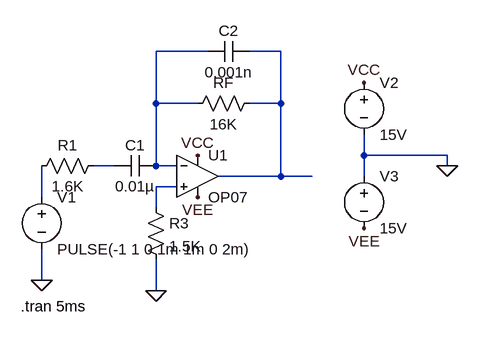
[diagram p0: schematic Draft2.asc]
Draft2.asc, the LTspice schematic file:
Version 4
SHEET 1 880 680
WIRE 208 -32 128 -32
WIRE 320 -32 272 -32
WIRE 128 48 128 -32
WIRE 192 48 128 48
WIRE 320 48 320 -32
WIRE 320 48 272 48
WIRE 448 128 448 96
WIRE 576 128 448 128
WIRE 64 144 32 144
WIRE 128 144 128 48
WIRE 160 144 128 144
WIRE 576 144 576 128
WIRE 320 160 320 48
WIRE 320 160 224 160
WIRE 368 160 320 160
WIRE 448 160 448 128
WIRE 160 176 128 176
WIRE -48 192 -48 144
WIRE 128 208 128 176
WIRE -48 320 -48 272
WIRE 128 336 128 288
FLAG -48 320 0
FLAG 576 144 0
FLAG 448 16 VCC
FLAG 192 128 VCC
FLAG 448 240 VEE
FLAG 192 192 VEE
FLAG 128 336 0
SYMBOL OpAmps\\OP07 192 96 R0
SYMATTR InstName U1
SYMBOL res 48 128 R90
WINDOW 0 0 56 VBottom 2
WINDOW 3 32 56 VTop 2
SYMATTR InstName R1
SYMATTR Value 1.6K
SYMBOL res 288 32 R90
WINDOW 0 0 56 VBottom 2
WINDOW 3 32 56 VTop 2
SYMATTR InstName RF
SYMATTR Value 16K
SYMBOL cap 128 128 R90
WINDOW 0 0 32 VBottom 2
WINDOW 3 32 32 VTop 2
SYMATTR InstName C1
SYMATTR Value 0.01µ
SYMBOL res 112 192 R0
SYMATTR InstName R3
SYMATTR Value 1.5K
SYMBOL cap 272 -48 R90
WINDOW 0 0 32 VBottom 2
WINDOW 3 32 32 VTop 2
SYMATTR InstName C2
SYMATTR Value 0.001n
SYMBOL voltage -48 176 R0
WINDOW 123 0 0 Left 0
WINDOW 39 0 0 Left 0
SYMATTR InstName V1
SYMATTR Value PULSE(-1 1 0 1m 1m 0 2m)
SYMBOL voltage 448 0 R0
WINDOW 123 0 0 Left 0
WINDOW 39 0 0 Left 0
SYMATTR InstName V2
SYMATTR Value 15V
SYMBOL voltage 448 144 R0
WINDOW 123 0 0 Left 0
WINDOW 39 0 0 Left 0
SYMATTR InstName V3
SYMATTR Value 15V
TEXT -80 360 Left 2 !.tran 5ms

The netlist it stands for:
* Draft2.asc
XU1 N004 N001 VCC VEE N002 LT1001  ; OP07, pins In+ In- V+ V- OUT
R1 N003 N005 1.6K
RF N002 N001 16K
C1 N001 N003 0.01µ
R3 N004 0 1.5K
C2 N002 N001 0.001n
V1 N005 0 PULSE(-1 1 0 1m 1m 0 2m)
V2 VCC 0 15V
V3 0 VEE 15V
.tran 5ms
.lib LTC.lib
.backanno
.end